# EAGLE design Danyboard_M0 (EAGLE 8.3.1)

## Sheet 1 of 3
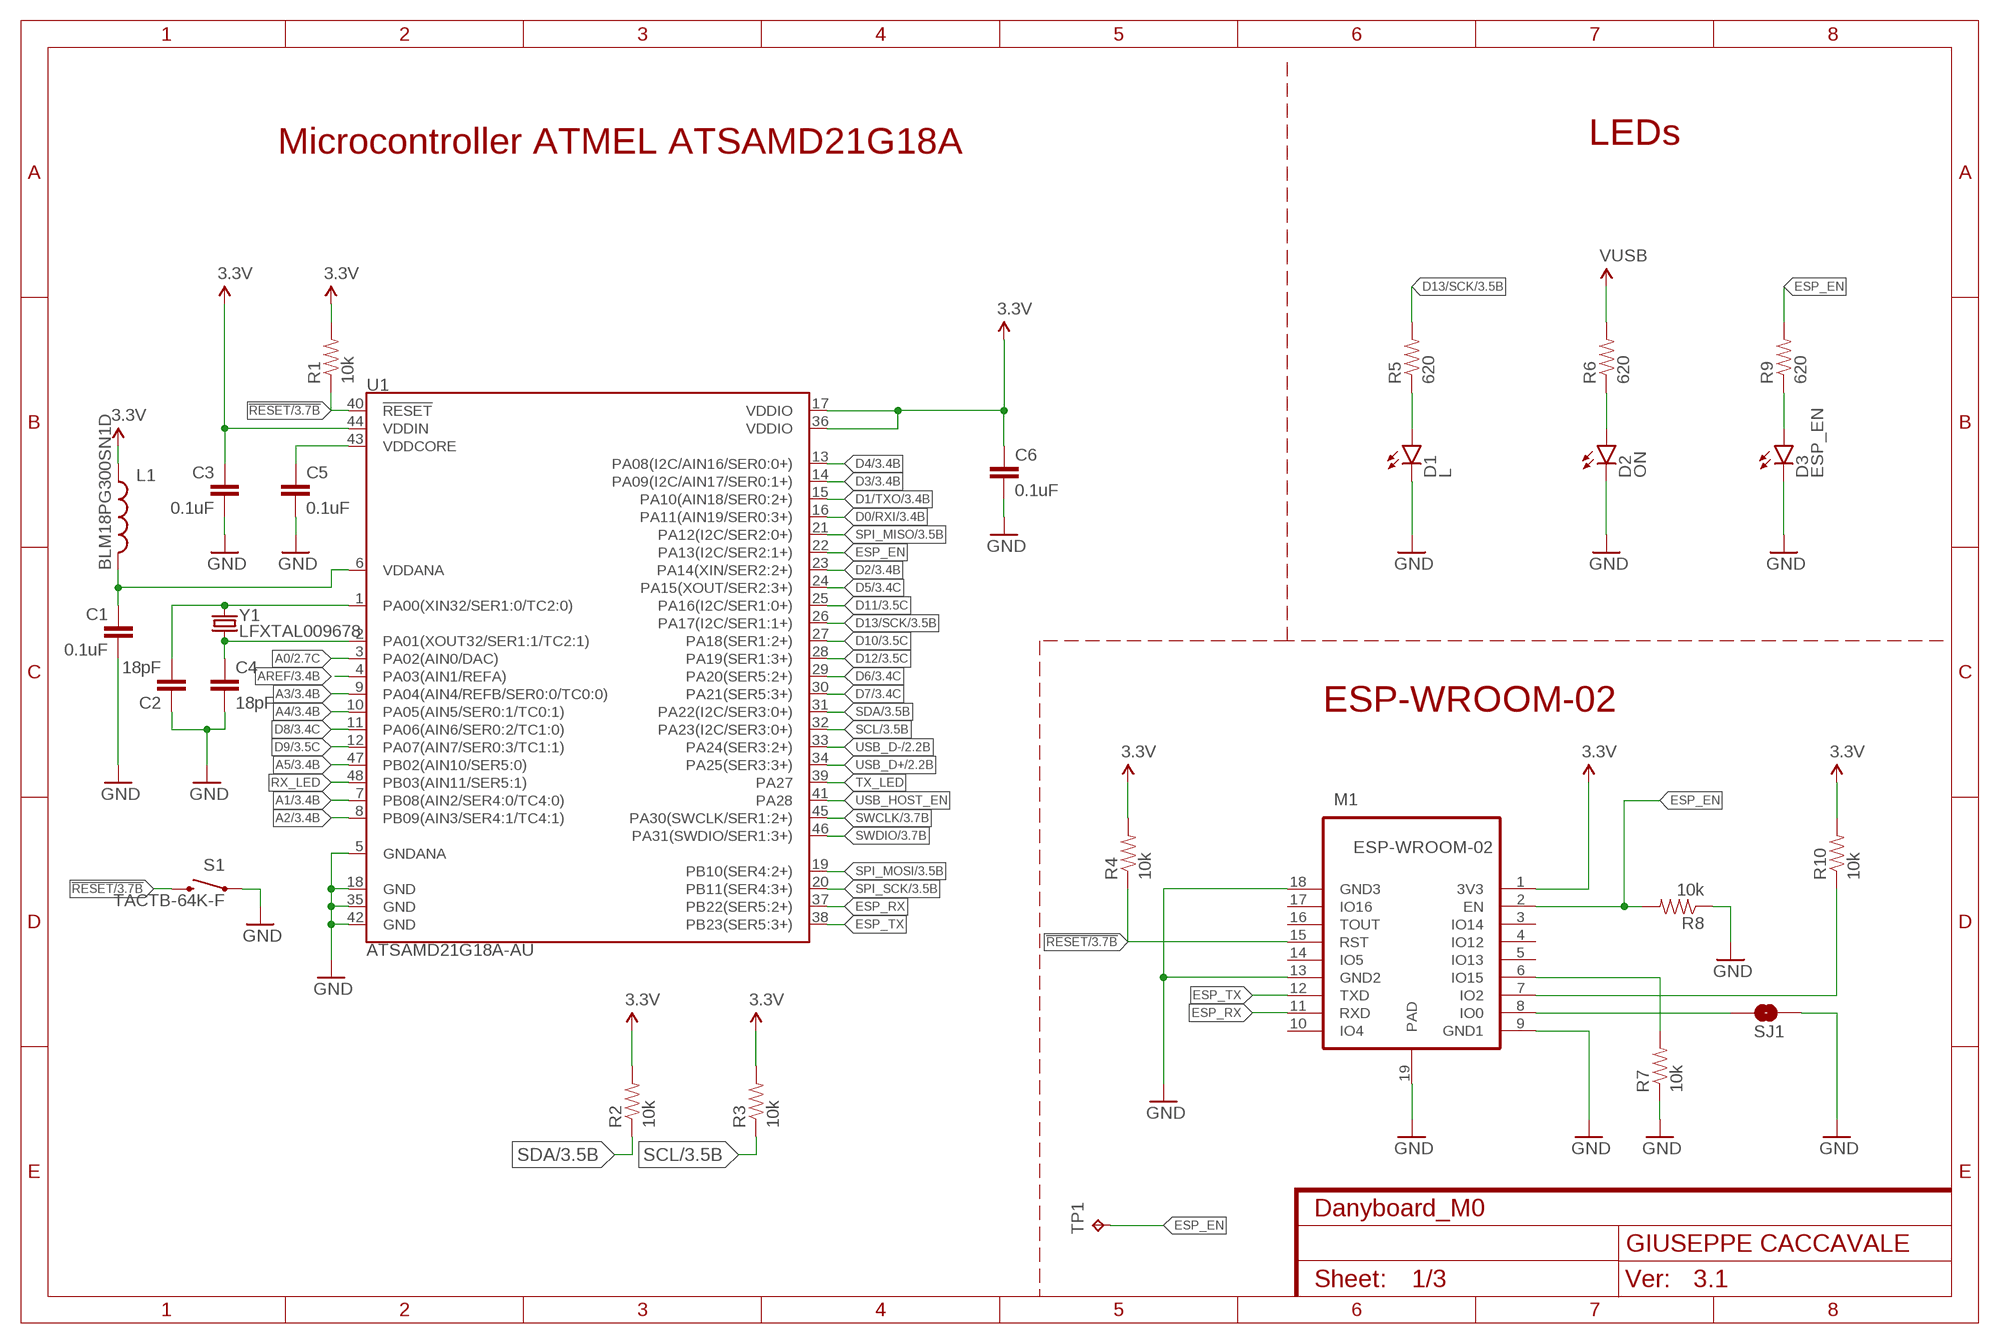
[diagram p0: schematic, sheet 1]

### Parts
C1  0.1uF  CAP0603-CAP_NS  [0603-CAP_NOSILK]
C2  18pF  CAP0603-CAP_NS  [0603-CAP_NOSILK]
C3  0.1uF  CAP0603-CAP_NS  [0603-CAP_NOSILK]
C4  18pF  CAP0603-CAP_NS  [0603-CAP_NOSILK]
C5  0.1uF  CAP0603-CAP_NS  [0603-CAP_NOSILK]
C6  0.1uF  CAP0603-CAP_NS  [0603-CAP_NOSILK]
D1  L  LED-BLUE0603  [LED-0603]
D2  ON  LED-BLUE0603  [LED-0603]
D3  ESP_EN  LED-BLUE0603  [LED-0603]
L1  BLM18PG300SN1D  INDUCTOR0603_NS  [0603_NOSILK]
M1  ESP-WROOM-02  ESP-WROOM-02-NS  [ESP-WROOM-02_NOSILK]
R1  10k  RESISTOR0603-NS  [0603-RES_NOSILK]
R2  10k  RESISTOR0603-NS  [0603-RES_NOSILK]
R3  10k  RESISTOR0603-NS  [0603-RES_NOSILK]
R4  10k  RESISTOR0603-NS  [0603-RES_NOSILK]
R5  620  RESISTOR0603-NS  [0603-RES_NOSILK]
R6  620  RESISTOR0603-NS  [0603-RES_NOSILK]
R7  10k  RESISTOR0603-NS  [0603-RES_NOSILK]
R8  10k  RESISTOR0603-NS  [0603-RES_NOSILK]
R9  620  RESISTOR0603-NS  [0603-RES_NOSILK]
R10  10k  RESISTOR0603-NS  [0603-RES_NOSILK]
S1  TACTB-64K-F  SWITCH-MOMENTARY-2SMD-NS  [TACTILE-SWITCH-SMD_NOSILK]
SJ1  SOLDERJUMPERNO  [SJ_2S-NO]
TP1  ESP8266  TPB1,27  [B1,27]
U1  ATSAMD21G18A-AU  ATSAMD21G-A2  [TQFP-48_NOSILK]
Y1  LFXTAL009678  CRYSTAL3.2X1.5MM_NS  [CRYSTAL-SMD-3.2X1.5MM_NOSILK]

### Nets
3.3V: C3.1 C6.1 L1.1 M1.1(3V3) R1.2 R2.2 R3.2 R4.2 R10.2 U1.17(VDDIO) U1.36(VDDIO) U1.44(VDDIN) ; also sheet 2,3
!RESET: M1.15(RST) R1.1 R4.1 S1.3 U1.40(!RESET!) ; also sheet 3
A0: U1.3(PA02(AIN0/DAC)) ; also sheet 2,3
A1: U1.7(PB08(AIN2/SER4:0/TC4:0)) ; also sheet 3
A2: U1.8(PB09(AIN3/SER4:1/TC4:1)) ; also sheet 3
A3: U1.9(PA04(AIN4/REFB/SER0:0/TC0:0)) ; also sheet 3
A4: U1.10(PA05(AIN5/SER0:1/TC0:1)) ; also sheet 3
A5: U1.47(PB02(AIN10/SER5:0)) ; also sheet 3
AREF: U1.4(PA03(AIN1/REFA)) ; also sheet 3
D0/RXI: U1.16(PA11(AIN19/SER0:3+)) ; also sheet 3
D1/TXO: U1.15(PA10(AIN18/SER0:2+)) ; also sheet 3
D2: U1.23(PA14(XIN/SER2:2+)) ; also sheet 3
D3: U1.14(PA09(I2C/AIN17/SER0:1+)) ; also sheet 3
D4: U1.13(PA08(I2C/AIN16/SER0:0+)) ; also sheet 3
D5: U1.24(PA15(XOUT/SER2:3+)) ; also sheet 3
D6: U1.29(PA20(SER5:2+)) ; also sheet 3
D7: U1.30(PA21(SER5:3+)) ; also sheet 3
D8: U1.11(PA06(AIN6/SER0:2/TC1:0)) ; also sheet 3
D9: U1.12(PA07(AIN7/SER0:3/TC1:1)) ; also sheet 3
D10: U1.27(PA18(SER1:2+)) ; also sheet 3
D11: U1.25(PA16(I2C/SER1:0+)) ; also sheet 3
D12: U1.28(PA19(SER1:3+)) ; also sheet 3
D13/SCK: R5.2 U1.26(PA17(I2C/SER1:1+)) ; also sheet 3
ESP_EN: M1.2(EN) R8.2 R9.2 TP1.TP U1.22(PA13(I2C/SER2:1+))
ESP_RX: M1.11(RXD) U1.37(PB22(SER5:2+))
ESP_TX: M1.12(TXD) U1.38(PB23(SER5:3+))
GND: C1.2 C2.1 C3.2 C4.2 C5.2 C6.2 D1.C D2.C D3.C M1.9(GND1) M1.13(GND2) M1.18(GND3) M1.19(PAD) R7.1 R8.1 S1.1 SJ1.2 U1.5(GNDANA) U1.18(GND) U1.35(GND) U1.42(GND) ; also sheet 2,3
N$2: C2.2 U1.1(PA00(XIN32/SER1:0/TC2:0)) Y1.P$2
N$4: C4.1 U1.2(PA01(XOUT32/SER1:1/TC2:1)) Y1.P$1
N$8: D1.A R5.1
N$11: M1.6(IO15) R7.2
N$12: M1.7(IO2) R10.1
N$13: M1.8(IO0) SJ1.1
N$14: D3.A R9.1
N$15: D2.A R6.1
RX_LED: U1.48(PB03(AIN11/SER5:1))
SCL: R3.1 U1.32(PA23(I2C/SER3:0+)) ; also sheet 3
SDA: R2.1 U1.31(PA22(I2C/SER3:0+)) ; also sheet 3
SPI_MISO: U1.21(PA12(I2C/SER2:0+)) ; also sheet 3
SPI_MOSI: U1.19(PB10(SER4:2+)) ; also sheet 3
SPI_SCK: U1.20(PB11(SER4:3+)) ; also sheet 3
SWCLK: U1.45(PA30(SWCLK/SER1:2+)) ; also sheet 3
SWDIO: U1.46(PA31(SWDIO/SER1:3+)) ; also sheet 3
TX_LED: U1.39(PA27)
USB_D+: U1.34(PA25(SER3:3+)) ; also sheet 2
USB_D-: U1.33(PA24(SER3:2+)) ; also sheet 2
USB_HOST_EN: U1.41(PA28)
VDDANA: C1.1 L1.2 U1.6(VDDANA)
VDDCORE: C5.1 U1.43(VDDCORE)
VUSB: R6.2 ; also sheet 2,3
Unconnected: M1.3(IO14) M1.4(IO12) M1.5(IO13) M1.10(IO4) M1.14(IO5) M1.16(TOUT) M1.17(IO16)

### Notes on the sheet
- Microcontroller ATMEL ATSAMD21G18A
- LEDs
- ESP-WROOM-02
- 3.1

## Sheet 2 of 3
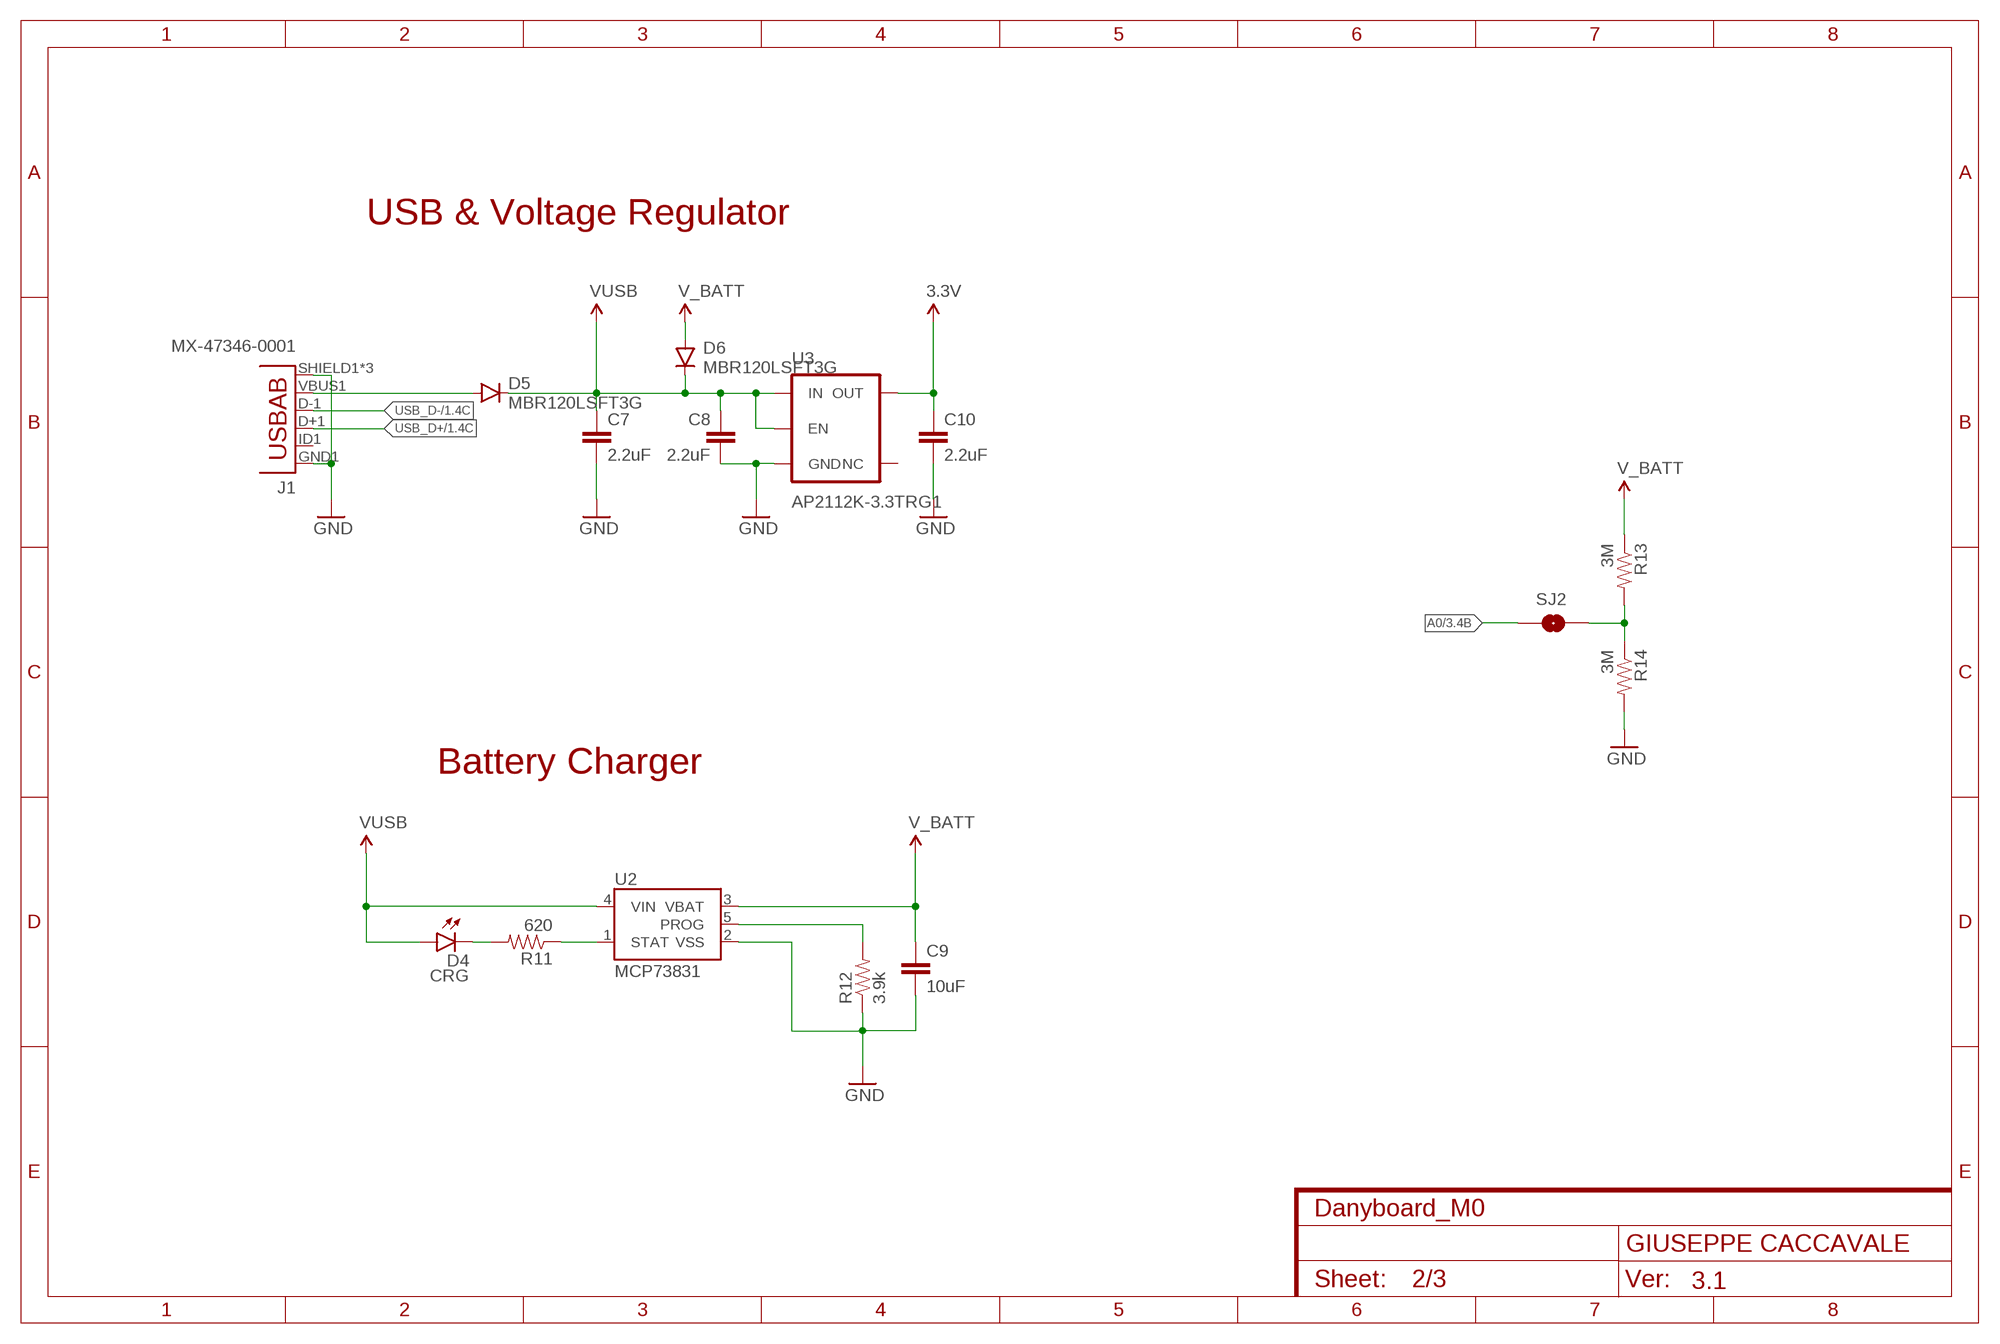
[diagram p1: schematic, sheet 2]

### Parts
C7  2.2uF  CAP0603-CAP_NS  [0603-CAP_NOSILK]
C8  2.2uF  CAP0603-CAP_NS  [0603-CAP_NOSILK]
C9  10uF  CAP0603-CAP_NS  [0603-CAP_NOSILK]
C10  2.2uF  CAP0603-CAP_NS  [0603-CAP_NOSILK]
D4  CRG  LED0603  [LED-0603]
D5  MBR120LSFT3G  DIODESOD123_NS  [SOD-123_NOSILK]
D6  MBR120LSFT3G  DIODESOD123_NS  [SOD-123_NOSILK]
J1  MX-47346-0001  USB-ABCONN-11794  [USB-AB-MICRO-SMD_V03]
R11  620  RESISTOR0603-NS  [0603-RES_NOSILK]
R12  3.9k  RESISTOR0603-NS  [0603-RES_NOSILK]
R13  3M  RESISTOR0603-NS  [0603-RES_NOSILK]
R14  3M  RESISTOR0603-NS  [0603-RES_NOSILK]
SJ2  SOLDERJUMPERNO  [SJ_2S-NO]
U2  MCP73831  [SOT23-5]
U3  AP2112K-3.3TRG1  V_REG_AP2112K-3.3V  [SOT23-5]

### Nets
3.3V: C10.1 U3.5(OUT) ; also sheet 1,3
A0: SJ2.1 ; also sheet 1,3
GND: C7.2 C8.2 C9.2 C10.2 J1.GND1(GND) J1.SHIELD1(SHIELD) J1.SHIELD2(SHIELD) J1.SHIELD3(SHIELD) R12.1 R14.2 U2.2(VSS) U3.2(GND) ; also sheet 1,3
N$3: D4.C R11.2
N$5: R11.1 U2.1(STAT)
N$6: R12.2 U2.5(PROG)
N$10: R13.2 R14.1 SJ2.2
N$18: D5.A J1.VBUS1(VBUS)
USB_D+: J1.D+1(D+) ; also sheet 1
USB_D-: J1.D-1(D-) ; also sheet 1
V_BATT: C9.1 D6.A R13.1 U2.3(VBAT) ; also sheet 3
VUSB: C7.1 C8.1 D4.A D5.C D6.C U2.4(VIN) U3.1(IN) U3.3(EN) ; also sheet 1,3
Unconnected: J1.ID1(USBID) U3.4(NC)

### Notes on the sheet
- USB & Voltage Regulator
- Battery Charger
- 3.1

## Sheet 3 of 3
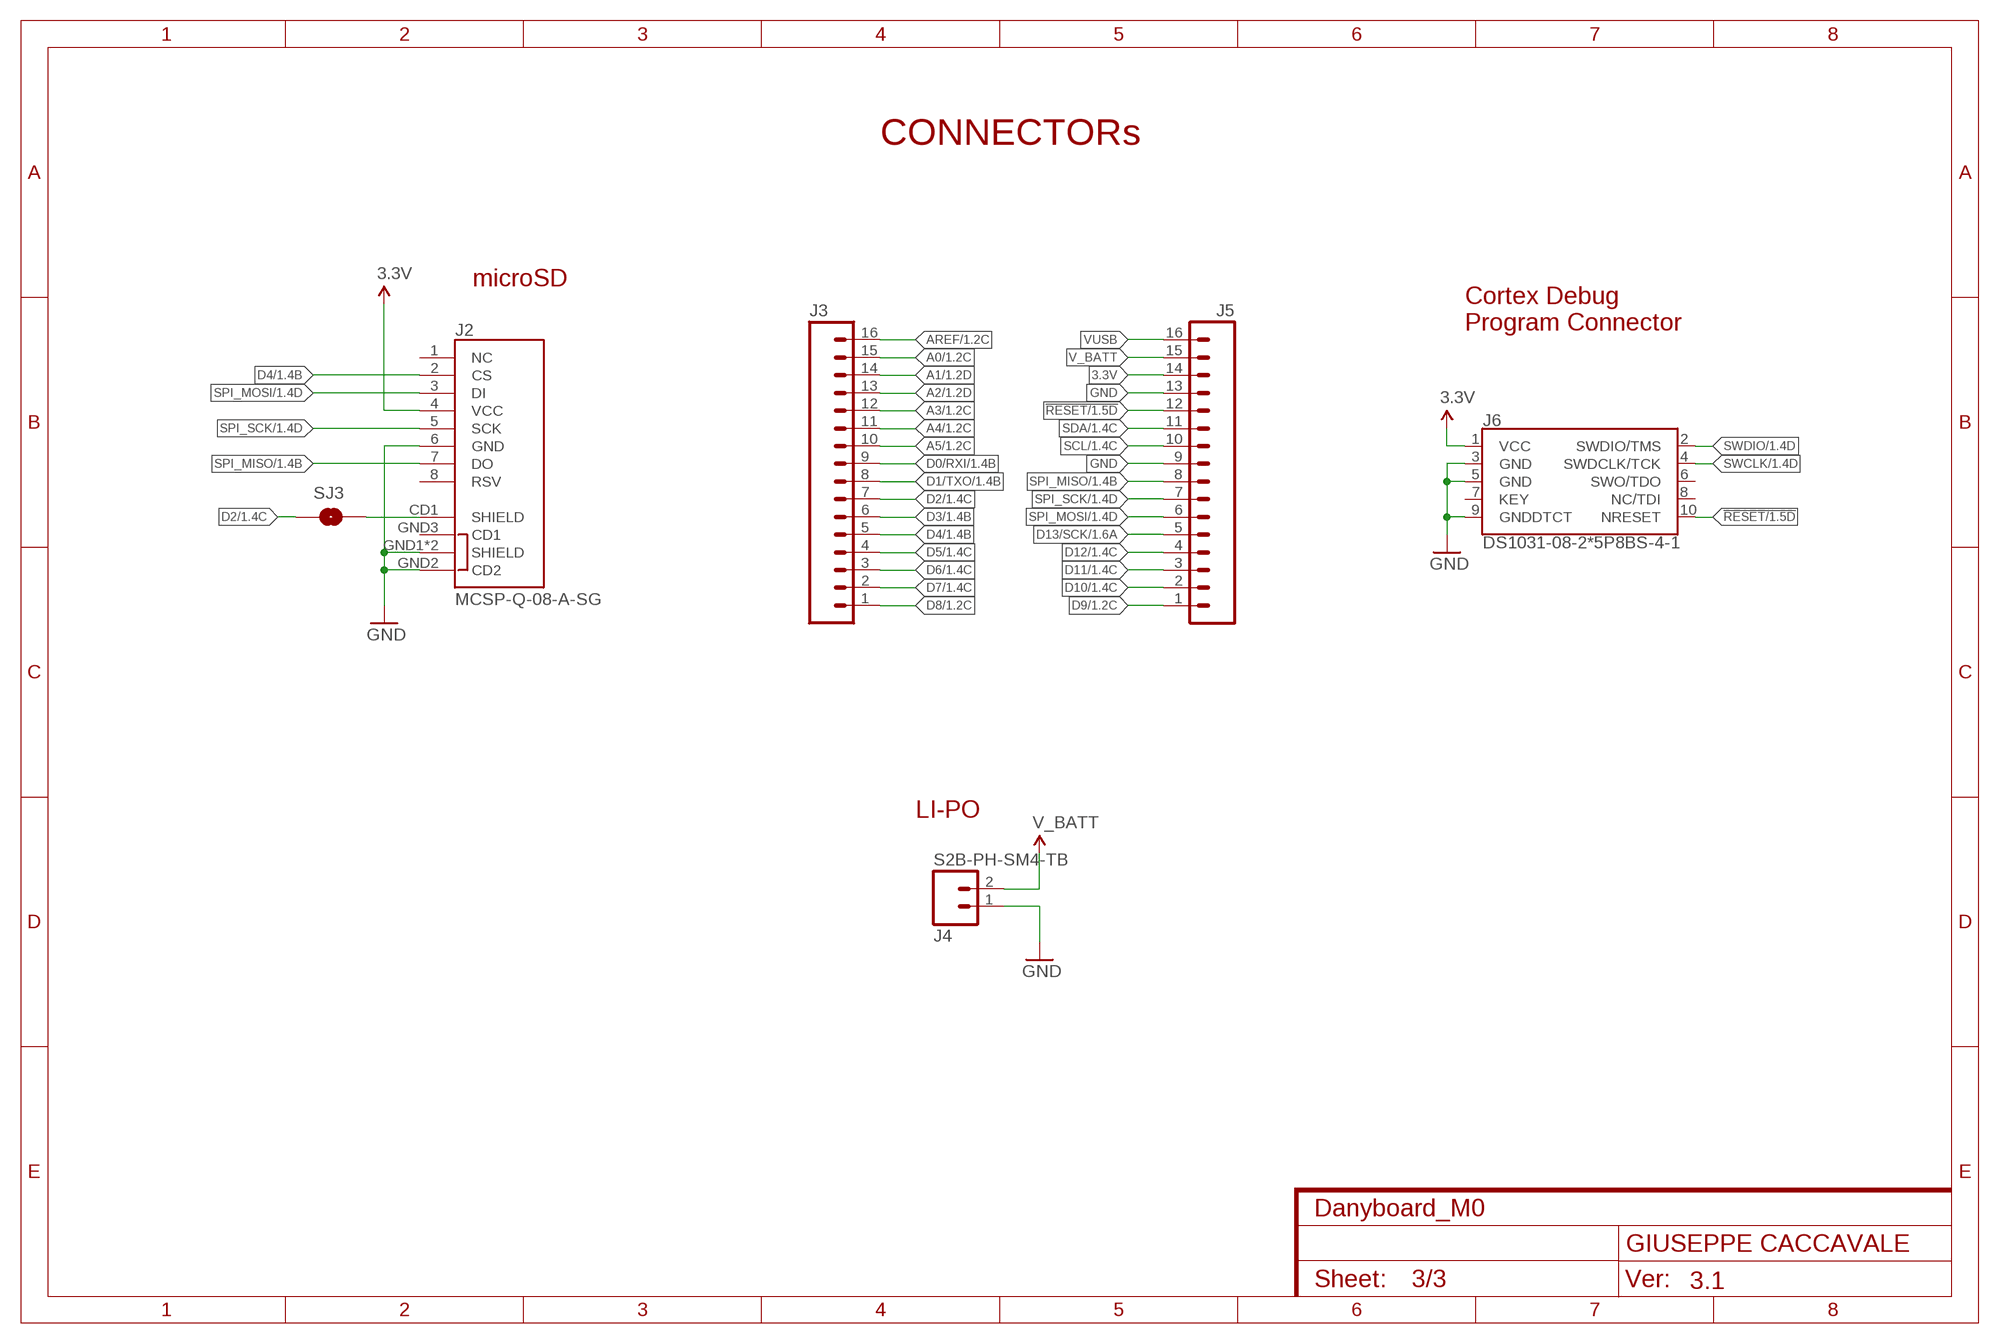
[diagram p2: schematic, sheet 3]

### Parts
J2  MCSP-Q-08-A-SG  USD-SOCKET-NS  [MCSP-Q-08-A-SG-T_NOSILK]
J3  M161X16_NO_SILK  [1X16_NO_SILK]
J4  S2B-PH-SM4-TB  M02-JST-2MM-SMT_NS  [JST-2-SMD_NOSILK]
J5  M161X16_NO_SILK  [1X16_NO_SILK]
J6  DS1031-08-2*5P8BS-4-1  CORTEX_DEBUGSMD2  [SAMTECH_FTSH-105-01_NOSILK]
SJ3  SOLDERJUMPERNO  [SJ_2S-NO]

### Nets
3.3V: J2.4(VCC) J5.14 J6.1(VCC) ; also sheet 1,2
!RESET: J5.12 J6.10(NRESET) ; also sheet 1
A0: J3.15 ; also sheet 1,2
A1: J3.14 ; also sheet 1
A2: J3.13 ; also sheet 1
A3: J3.12 ; also sheet 1
A4: J3.11 ; also sheet 1
A5: J3.10 ; also sheet 1
AREF: J3.16 ; also sheet 1
D0/RXI: J3.9 ; also sheet 1
D1/TXO: J3.8 ; also sheet 1
D2: J3.7 SJ3.1 ; also sheet 1
D3: J3.6 ; also sheet 1
D4: J2.2(CS) J3.5 ; also sheet 1
D5: J3.4 ; also sheet 1
D6: J3.3 ; also sheet 1
D7: J3.2 ; also sheet 1
D8: J3.1 ; also sheet 1
D9: J5.1 ; also sheet 1
D10: J5.2 ; also sheet 1
D11: J5.3 ; also sheet 1
D12: J5.4 ; also sheet 1
D13/SCK: J5.5 ; also sheet 1
GND: J2.6(GND) J2.GND1(SHIELD) J2.GND2(CD2) J2.GND4(SHIELD) J4.1 J5.9 J5.13 J6.3(GND) J6.5(GND) J6.9(GNDDTCT) ; also sheet 1,2
N$16: J2.CD1(SHIELD) SJ3.2
SCL: J5.10 ; also sheet 1
SDA: J5.11 ; also sheet 1
SPI_MISO: J2.7(DO) J5.8 ; also sheet 1
SPI_MOSI: J2.3(DI) J5.6 ; also sheet 1
SPI_SCK: J2.5(SCK) J5.7 ; also sheet 1
SWCLK: J6.4(SWDCLK/TCK) ; also sheet 1
SWDIO: J6.2(SWDIO/TMS) ; also sheet 1
V_BATT: J4.2 J5.15 ; also sheet 2
VUSB: J5.16 ; also sheet 1,2
Unconnected: J2.1(NC) J2.8(RSV) J2.GND3(CD1) J6.6(SWO/TDO) J6.7(KEY) J6.8(NC/TDI)

### Notes on the sheet
- CONNECTORs
- microSD
- Cortex Debug
  Program Connector
- LI-PO
- 3.1

## Library data of the parts
C1-C10 = Danyboard:CAP: Capacitor Standard 0603 ceramic capacitor, and 0.1" leaded capacitor.
D1-D3 = SparkFun-LED:LED-BLUE: Blue LEDs for production use Various blue LEDs stocked by SparkFun production 0603 - DIO-08575 Rebel - DIO-09553 1206 - DIO-09911; PROD_ID: DIO-08575; VALUE: BLUE
D4 = SparkFun-LED:LED: LEDs Standard schematic elements and footprints for 5mm, 3mm, 1206, and 0603 sized LEDs. 5mm - Spark Fun Electronics SKU : COM-00529 (and others)
D5 D6 = Danyboard:DIODE: Diode These are standard reverse protection diodes and small signal diodes. SMA package can handle up to about 1A. SOD-323 can handle about 200mA. What the SOD-323 package when ordering, there are some mfgs out there that are 5-pin packages.
J1 = Danyboard:USB-AB: This is a USB AB connector that is compatible with USB OTG. i.e. this connector can serve as a host or device; PROD_ID: CONN-11794
J2 = Danyboard:USD-SOCKET: microSD Socket Push-push type uSD socket. Schematic element and footprint production proven. Spark Fun Electronics SKU : PRT-00127. tDoc lines correctly indicate media card edge positions when inserting (unlocked, locked, depressed). NOTE: CD1 and CD2 are connected internally
J3 J5 = SparkFun-Connectors:M16: 1x16 .1" header
J4 = Danyboard:M02: Standard 2-pin 0.1" header. Use with - straight break away headers ( PRT-00116) - right angle break away headers (PRT-00553) - swiss pins (PRT-00743) - machine pins (PRT-00117) - female headers (PRT-00115) Molex polarized connector foot print use with: PRT-08233 with associated crimp pins and housings. 2.54_SCREWTERM for use with PRT-10571. 3.5mm Screw Terminal footprints for PRT-08084 5mm Screw Terminal footprints for use with PRT-08432
J6 = Danyboard:CORTEX_DEBUG: Cortex Debug Connector Datasheet <http://infocenter.arm.com/help/topic/com.arm.doc.faqs/attached/13634/cortex_debug_connectors.pdf>
L1 = Danyboard:INDUCTOR: Inductors Basic Inductor/Choke - 0603 and 1206. Footprints are not proven and vary greatly between part numbers. INDUCTOR POWER 3.3UH 4.0A SMD 0.197" L x 0.197" W x 0.177" H (5.00mm x 5.00mm x 4.50mm); PROD_ID: RES-07859
M1 = Danyboard:ESP-WROOM-02: WiFi module - ESP-WROOM-02
R1-R14 = Danyboard:RESISTOR: Resistor Basic schematic elements and footprints for 0603, 1206, and PTH resistors.
S1 = Danyboard:SWITCH-MOMENTARY-2: Various NO switches- pushbuttons, reed, etc
SJ1-SJ3 = SparkFun-Retired:SOLDERJUMPER: Solder Jumper Standard SMD solder jumper. Used to automate production. Two varients : Normally Open and Normally Closed are the same, but have different paste layers. NC will have a large amount of paste and should jumper during reflow.
TP1 = testpad:TP: Test pad
U1 = Danyboard:ATSAMD21G: Atmel SAMD21G SMART ARM-Based Microcontroller The Atmel ® | SMART  SAM D21 is a series of low-power microcontrollers using the 32-bit ARM ® Cortex ® -M0+ processor, and ranging from 32- to 64-pins with up to 256KB Flash and 32KB of SRAM. The SAM D21 devices operate at a maximum frequency of 48MHz and reach 2.46 CoreMark/MHz. They are designed for simple and intuitive migration with identical peripheral modules, hex compatible code, identical linear address map and pin compatible migration paths between all devices in the product series. All devices include intelligent and flexible peripherals, Atmel Event System for inter-peripheral signaling, and support for capacitive touch button, slider and wheel user interfaces.
U2 = SparkFun-PowerIC:MCP73831: Miniature single cell, fully integrated Li-Ion, Li-polymer charge management controller http://ww1.microchip.com/downloads/en/DeviceDoc/20001984g.pdf IC-09995; PROD_ID: IC-09995
U3 = SparkFun-PowerIC:V_REG_AP2112: AP2112 - 600mA CMOS LDO Regulator w/ Enable The AP2112 is CMOS process low dropout linear regulator with enable function, the regulator delivers a guaranteed 600mA (min.) continuous load current. Features Output Voltage Accuracy: ±1.5% Output Current: 600mA (Min.) Foldback Short Current Protection: 50mA Enable Function to Turn ON/OFF VOUT Low Dropout Voltage (3.3V): 250mV (Typ.) @IOUT=600mA Excellent Load Regulation: 0.2%/A (Typ.) Excellent Line Regulation: 0.02%/V (Typ.) Low Quiescent Current: 55μA (Typ.) Low Standby Current: 0.01μA (Typ.) Low Output Noise: 50μVRMS PSRR: 100Hz -65dB, 1kHz -65dB OTSD Protection Stable with 1.0μF Flexible Cap: Ceramic, Tantalum and Aluminum Electrolytic Operation Temperature Range: -40°C to 85°C ESD: MM 400V, HBM 4000V; PROD_ID: VREG-12457; VALUE: 3.3V
Y1 = Danyboard:CRYSTAL: Various standard crystals. Proven footprints.

## Board
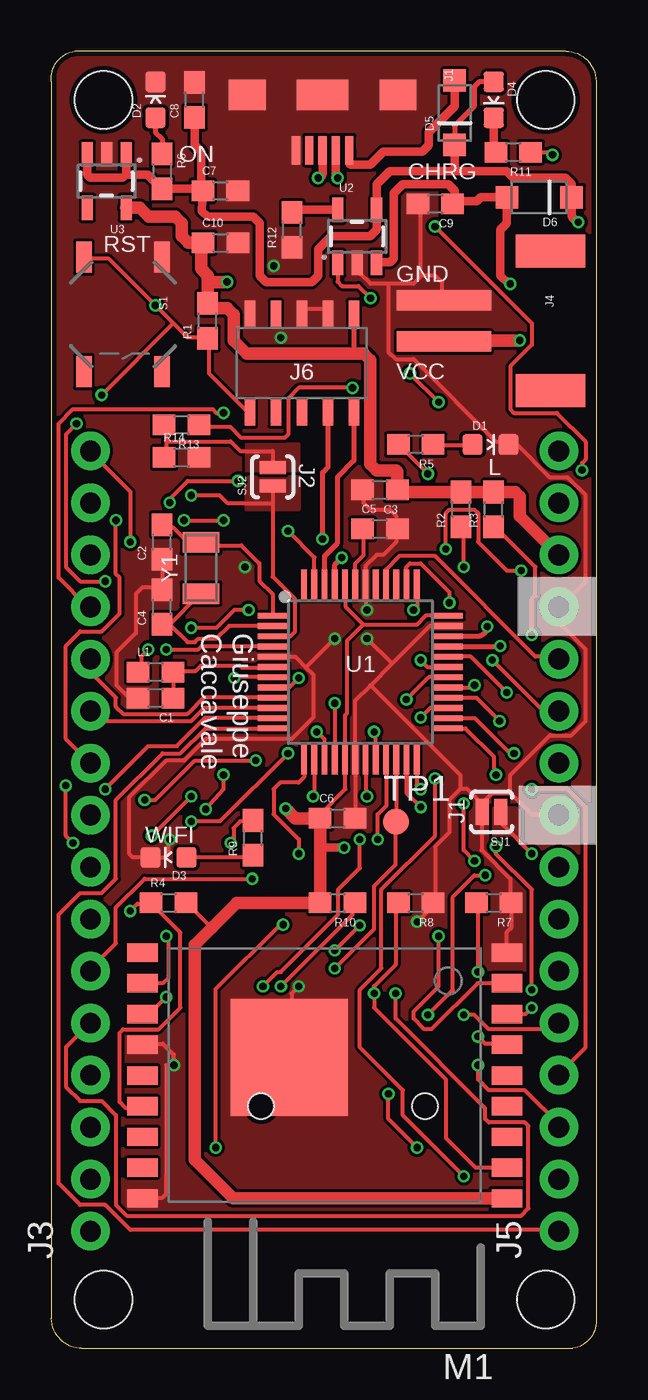
[diagram p3: board, top side]
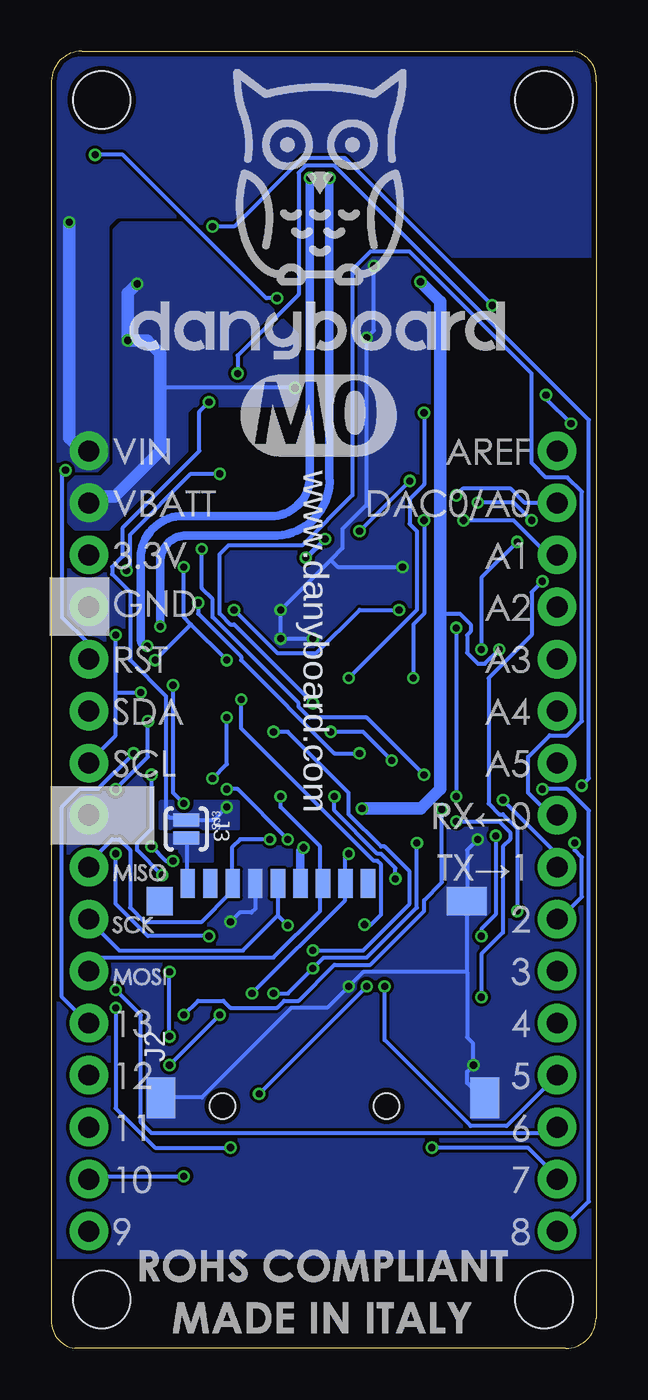
[diagram p4: board, bottom side, seen from below]

Size 26.61 x 63.34 mm. Coordinates in mm from the lower left corner, seen from the top.
Outline: 1.5,0 25.45,0 arc89 26.6,1.49 26.6,61.87 arc89 25.12,63.34 1.15,63.34 arc89 0.01,61.85 0.01,1.46 arc89 1.5,0
Copper layers (1*16): Top 0.018mm / dielectric 1.55mm / Bottom 0.018mm
Design rules "eC_2Layer_PClass6_BaseCopperO18_eCDefault": minimum track width 0.15mm, minimum drill 0.35mm, track to track 0.15mm, track to pad 0.15mm, pad to pad 0.15mm, via to via 0.15mm, smd to smd 0mil, copper to edge 0.25mm, drill to drill 0.35mm, minimum pad ring 0.175mm, minimum via ring 0.125mm, stop-mask expansion 0mil, vias tented up to drill 0.45mm, thermal gap 0.2mm
Holes 2.8 mm at 24.14,60.96 2.55,60.96 2.55,2.38 24.14,2.38

### Footprints (pad centres in the part's own frame; a part is rotated, then mirrored left to right if it is on the bottom)
0603-CAP_NOSILK = smd 1.1 x 1: 1 -0.85,0; 2 0.85,0
LED-0603 = smd 1 x 1: A 0,-0.877; C 0,0.877
SOD-123_NOSILK = smd 1.1 x 1.1: A 1.575,0; C -1.575,0
USB-AB-MICRO-SMD_V03 = smd 1.4 x 0.4: D+1 2.7,0; D-1 2.7,0.65; GND1 2.7,-1.3; ID1 2.7,-0.65; VBUS1 2.7,1.3 | smd 1.5 x 1.8: SHIELD1 0,3.68; SHIELD3 0,-3.68 | smd 1.5 x 2.5: SHIELD2 0,0
MCSP-Q-08-A-SG-T_NOSILK = smd 0.7 x 1.4: 1 2.2,6.35; 2 1.1,6.35; 3 0,6.35; 4 -1.1,6.35; 5 -2.2,6.35; 6 -3.3,6.35; 7 -4.4,6.35; 8 -5.5,6.35; CD1 -6.6,6.35 | smd 1.4 x 2: GND1 -7.9,-4.12; GND2 7.9,-4.12 | smd 1.28 x 1.4: GND3 -7.96,5.48 | smd 1.95 x 1.4: GND4 7.025,5.48 | hole 1.25: 3.1,-4.52; -4.9,-4.52
1X16_NO_SILK = drill 1.016 pad 1.88: 1 0,0; 2 2.54,0; 3 5.08,0; 4 7.62,0; 5 10.16,0; 6 12.7,0; 7 15.24,0; 8 17.78,0; 9 20.32,0; 10 22.86,0; 11 25.4,0; 12 27.94,0; 13 30.48,0; 14 33.02,0; 15 35.56,0; 16 38.1,0
JST-2-SMD_NOSILK = smd 1 x 4.6: 1 -1,-3.7; 2 1,-3.7 | smd 1.6 x 3.4: NC1 -3.4,1.5; NC2 3.4,1.5
SAMTECH_FTSH-105-01_NOSILK = smd 0.508 x 1.27: 1 -2.54,-2.413; 2 -2.54,2.413; 3 -1.27,-2.413; 4 -1.27,2.413; 5 0,-2.413; 6 0,2.413; 7 1.27,-2.413; 8 1.27,2.413; 9 2.54,-2.413; 10 2.54,2.413
0603_NOSILK = smd 1.1 x 1: 1 -0.85,0; 2 0.85,0
ESP-WROOM-02_NOSILK = smd 1.485 x 0.9: 1 -8.893,4.9; 2 -8.893,3.4; 3 -8.893,1.9; 4 -8.893,0.4; 5 -8.893,-1.1; 6 -8.893,-2.6; 7 -8.893,-4.1; 8 -8.893,-5.6; 9 -8.893,-7.1; 10 8.893,-7.1; 11 8.893,-5.6; 12 8.893,-4.1; 13 8.893,-2.6; 14 8.893,-1.1; 15 8.893,0.4; 16 8.893,1.9; 17 8.893,3.4; 18 8.893,4.9 | smd 5.715 x 5.715: 19 1.72,-1.98
0603-RES_NOSILK = smd 1.1 x 1: 1 -0.85,0; 2 0.85,0
TACTILE-SWITCH-SMD_NOSILK = smd 1.524 x 0.762: 1 -2.794,1.905; 2 2.794,1.905; 3 -2.794,-1.905; 4 2.794,-1.905
SJ_2S-NO = smd 0.635 x 1.27: 1 -0.45,0; 2 0.45,0
B1,27 = smd 1.27 x 1.27: TP 0,0
TQFP-48_NOSILK = smd 1.5 x 0.28: 1 -4.25,2.75; 2 -4.25,2.25; 3 -4.25,1.75; 4 -4.25,1.25; 5 -4.25,0.75; 6 -4.25,0.25; 7 -4.25,-0.25; 8 -4.25,-0.75; 9 -4.25,-1.25; 10 -4.25,-1.75; 11 -4.25,-2.25; 12 -4.25,-2.75; 25 4.25,-2.75; 26 4.25,-2.25; 27 4.25,-1.75; 28 4.25,-1.25; 29 4.25,-0.75; 30 4.25,-0.25; 31 4.25,0.25; 32 4.25,0.75; 33 4.25,1.25; 34 4.25,1.75; 35 4.25,2.25; 36 4.25,2.75 | smd 0.28 x 1.5: 13 -2.75,-4.25; 14 -2.25,-4.25; 15 -1.75,-4.25; 16 -1.25,-4.25; 17 -0.75,-4.25; 18 -0.25,-4.25; 19 0.25,-4.25; 20 0.75,-4.25; 21 1.25,-4.25; 22 1.75,-4.25; 23 2.25,-4.25; 24 2.75,-4.25; 37 2.75,4.25; 38 2.25,4.25; 39 1.75,4.25; 40 1.25,4.25; 41 0.75,4.25; 42 0.25,4.25; 43 -0.25,4.25; 44 -0.75,4.25; 45 -1.25,4.25; 46 -1.75,4.25; 47 -2.25,4.25; 48 -2.75,4.25
SOT23-5 = smd 0.55 x 1.2: 1 -0.95,-1.3; 2 0,-1.3; 3 0.95,-1.3; 4 0.95,1.3; 5 -0.95,1.3
CRYSTAL-SMD-3.2X1.5MM_NOSILK = smd 1 x 1.8: P$1 -1.25,0; P$2 1.25,0

### Placement (x,y rotation side)
C1  5.09,31.75 180 top
C2  5.41,39.37 90 top
C3  16.04,41.91 180 top
C4  5.41,36.2 90 top
C5  16.04,40.01 0 top
C6  13.98,25.88 0 top
C7  8.26,56.52 0 top
C8  6.99,60.96 90 top
C9  18.74,55.88 180 top
C10  8.26,53.98 0 top
D1  21.44,44.13 270 top
D2  5.09,60.96 0 top
D3  5.72,23.97 90 top
D4  21.6,60.96 180 top
D5  19.69,60.33 90 top
D6  23.82,56.2 180 top
J1  13.24,61.2 270 top
J2  13.34,16.35 0 bottom
J3  1.91,5.71 90 top
J4  22.87,50.16 270 top
J5  24.77,5.71 90 top
J6  12.23,48.1 180 top
L1  5.09,33.02 0 top
M1  13.34,12.22 180 top
R1  7.63,50.16 90 top
R2  20.01,40.96 90 top
R3  21.6,40.96 90 top
R4  5.72,21.75 0 top
R5  17.79,44.13 180 top
R6  5.41,57.47 270 top
R7  21.6,21.75 180 top
R8  17.79,21.75 180 top
R9  9.85,24.92 90 top
R10  13.98,21.75 180 top
R11  22.55,58.4 180 top
R12  11.76,54.61 90 top
R13  6.36,45.09 180 top
R14  6.36,43.5 0 top
S1  3.5,50.48 270 top
SJ1  21.5,26.19 180 top
SJ2  10.8,42.55 90 top
SJ3  20.01,25.36 270 bottom
TP1  16.84,25.72 0 top
U1  15.09,33.02 0 top
U2  14.93,54.29 0 top
U3  2.71,56.99 180 top
U$2  [DANYBOARD_M0_FONTPRINT_BOTTOM_NEW]  26.68,0 0 bottom
Y1  7.31,38.1 90 top

### Tracks (layer width: path | path; a pad name or v marks a point on that pad's centre or on a via)
3.3V  (via drill 0.35)
  Top 0.2: 15.23,35.35 17.86,35.35 18.28,35.77 U1.36 | 15.23,35.35 14.36,36.23 14.36,37.1 U1.44 | v4.73,34.12 4.38,33.77 4.38,33.08 L1.1 | 7.83,20.52 6.66,21.7 R4.2 | C6.1 13.13,26.07 14.36,27.3 14.36,28.7 U1.17 14.34,30.91 14.44,31.02 14.44,34.56 15.23,35.35
  Top 0.254: J6.1 14.77,48.74 14.93,48.58
  Top 0.406: 7.31,53.92 C10.1 | 13.03,25.77 C6.1 | v14.3,24.45 13.15,24.45 13.15,24.47 | 13.15,24.48 13.15,24.47 | 13.15,24.47 13.13,24.45
  Top 0.61: M1.1 8.88,7.32 6.99,9.21 6.99,19.68 7.83,20.52 9.06,21.75 R10.2 13.13,24.45 C6.1 11.92,25.88 v11.44,26.35 | J5.14 22.87,40.64 22.87,41.59 22.65,41.81 R3.2 R2.2 17,41.81 C3.1 16.89,42.81 16.84,42.86 15.88,42.86 15.57,43.18 15.57,48.26 15.25,48.58 14.93,48.58 9.53,48.58 8.9,49.21 8.9,50.48 8.58,50.8 7.84,50.8 R1.2 7.63,52.07 | 7.63,52.07 7.63,52.39 7.31,52.7 7.31,53.87 C10.1 6.68,53.98 6.36,54.29 6.36,54.93 6.04,55.24 4.77,55.24 4.33,55.69 U3.5 | v8.58,52.07 7.63,52.07
  Bottom 0.2: v4.73,34.12 5.43,33.42 5.78,33.42 6.31,33.95 6.31,34.83 6.13,35 6.13,35.35 6.66,35.88 7.63,35.88
  Bottom 0.406: J2.4 14.44,24.3 v14.3,24.45
  Bottom 0.61: v11.44,26.35 8.58,26.35 7.63,27.3 7.63,35.88 7.63,51.12 v8.58,52.07
!RESET  (via drill 0.35)
  Top 0.2: J5.12 24.68,33.77 23.63,33.77 18.73,38.67 16.98,38.67 16.34,38.03 U1.40 | M1.15 4.38,11.72 3.65,11.72 3.34,12.03 3.34,12.77 3.33,12.78 3.33,15.4 3.51,15.57 5.26,15.57 6.31,16.62 6.31,20.3 4.91,21.7 R4.1 4.73,21.7 4.21,21.7 v3.86,21.35 | J6.10 9.63,45.67 7.71,47.6 7.71,49.17 R1.1 7.53,49.35 6.66,49.35 5.96,50.05 | 5.96,50.05 v5.08,50.92 2.81,53.2 1.76,53.2 S1.3 | v2.63,37.45 1.41,37.45 0.71,38.15 0.71,44.62 v1.23,45.15 | 5.96,50.05 v2.46,46.55 | v25.91,42.88 25.91,43.23 26.08,43.4 26.08,44.27 24.68,45.67 22.58,45.67 22.41,45.85 22.41,47.95 23.46,49 23.46,50.05 v18.73,54.77
  Bottom 0.2: v3.86,21.35 3.86,25.38 4.56,26.07 4.73,26.07 5.26,26.6 5.26,32.73 3.16,34.83 3.16,36.92 v2.63,37.45 | v1.23,45.15 2.46,46.38 v2.46,46.55 | v25.91,42.88 26.08,42.7 26.08,35.7 24.86,34.48 24.86,33.77 J5.12 | v18.73,54.77 17.68,54.77 14.36,58.1 12.26,58.1 v5.08,50.92
A0  (via drill 0.35)
  Top 0.2: U1.3 11.68,34.77 11.91,35 11.91,36.58 10.8,37.68 10.8,41.27 | SJ2.1 10.8,41.27 | v6.83,41.65 8.21,41.65 8.58,41.27 10.8,41.27
  Bottom 0.2: v6.83,41.65 6.48,42 4.21,42 3.51,41.3 1.93,41.3 J3.15
  pour Top (no thermals): 9.85,42.55 12.07,42.55 12.07,40.96 9.53,40.96 9.53,42.55
A1  (via drill 0.35)
  Top 0.2: v6.48,40.42 v8.41,40.42 | U1.7 8.98,32.77 v8.93,32.73
  Bottom 0.2: v8.93,32.73 8.93,35.35 8.41,35.88 v8.41,40.42 | v6.48,40.42 4.03,40.42 2.46,38.85 1.93,38.85 J3.14
A2  (via drill 0.35)
  Top 0.2: v8.41,45.67 8.06,45.67 7.88,45.85 1.06,45.85 0.36,45.15 0.36,37.62 1.76,36.23 J3.13 | U1.8 11.63,32.27 v12.08,32.73
  Bottom 0.2: v12.08,32.73 8.76,36.05 8.76,39.9 9.11,40.25 9.11,41.48 8.41,42.17 v8.41,45.67
A3
  Top 0.2: 1.93,33.25 1.93,33.6 J3.12 1.91,33.02 3.16,31.77 3.16,31.32 3.51,30.98 6.66,30.98 7.45,31.77 U1.9
A4
  Top 0.2: J3.11 1.93,30.98 2.28,30.62 6.83,30.62 7.48,31.27 U1.10
A5  (via drill 0.35)
  Top 0.2: v11.56,39.9 12.84,38.62 U1.47 | v9.11,42.35 6.66,42.35 5.78,41.48 v5.78,41.3 | v3.16,40.42 3.16,37.8 3.33,37.62 3.33,35.88 2.46,35 1.41,35 0.71,34.3 0.71,29.75 1.76,28.7 J3.10
  Bottom 0.2: v9.11,42.35 v11.56,39.9 | v5.78,41.3 4.03,41.3 v3.16,40.42
AREF  (via drill 0.35)
  Top 0.2: v5.61,34.12 7.18,34.12 7.33,34.27 U1.4 | v3.86,39.38 3.86,41.83 1.93,43.75 J3.16
  Bottom 0.2: v5.61,34.12 5.61,37.62 v3.86,39.38
D0/RXI  (via drill 0.35)
  Top 0.2: v13.83,31.5 13.83,28.88 U1.16
  Bottom 0.2: v13.83,31.5 17.68,35.35 17.86,35.35 18.38,35.88 18.38,38.77 17.96,39.2 14.36,39.2 11.91,41.65 11.91,52.67 11.03,53.55 9.11,53.55 3.16,47.6 3.16,43.23 2.46,42.52 1.41,42.52 0.71,41.83 0.71,30.62 1.41,29.93 2.28,29.93 3.33,28.88 3.33,27.12 2.28,26.07 1.93,26.07 J3.9
D1/TXO  (via drill 0.35)
  Top 0.2: v12.96,30.1 13.34,29.72 U1.15 | v9.98,28.7 7.01,28.7 5.08,26.77 v4.56,26.77
  Bottom 0.2: v12.96,30.1 11.38,30.1 v9.98,28.7 | v4.56,26.77 1.93,24.15 1.93,23.62 J3.8
D2  (via drill 0.35)
  Top 0.2: v18.03,26.43 17.33,27.12 17.33,28.7 U1.23 | v17.51,47.6 v18.91,46.2 | v0.71,27.48 0.71,25.02 v1.06,24.68
  Bottom 0.2: v18.03,26.43 18.65,25.81 SJ3.1 | 19.96,25.9 SJ3.1 | v17.51,47.6 17.51,48.48 14.53,51.45 14.53,57.4 14.18,57.75 12.78,57.75 0.36,45.33 0.36,27.82 v0.71,27.48 | v1.06,24.68 1.06,24.32 0.71,23.98 0.71,22.05 1.76,21 J3.7 | SJ3.1 20.04,25.81 20.13,25.9 20.83,25.9 21.01,26.08 21.01,31.85 22.76,33.6 22.76,36.92 23.63,37.8 23.63,38.15 23.11,38.67 23.11,40.08 19.38,43.81 19.38,45.73 v18.91,46.2
  pour Bottom (no thermals): 18.74,25.4 17.47,25.4 17.47,26.67 21.28,26.67 21.28,25.4 19.06,25.4
D3  (via drill 0.35)
  Top 0.2: v9.81,22.93 4.56,22.93 3.16,21.52 3.16,19.77 1.93,18.55 J3.6 | U1.14 12.84,27.01 v12.78,26.95
  Bottom 0.2: v12.78,26.95 12.78,26.25 10.68,24.15 10.51,24.15 9.81,23.45 v9.81,22.93
D4  (via drill 0.35)
  Top 0.2: v12.08,24.15 12.08,24.85 10.86,26.07 10.86,27.3 11.18,27.62 12.07,27.62 12.34,27.89 U1.13 | v16.81,17.32 16.81,16.1 21.18,11.72 21.18,11.2 21.36,11.03 23.11,11.03 23.28,10.85 23.28,6.83 22.93,6.47 3.68,6.47 3.16,7 3.16,11.38 2.46,12.07 1.41,12.07 0.71,12.78 0.71,14.7 1.76,15.75 J3.5
  Bottom 0.2: v16.81,17.32 12.26,21.88 12.26,22.69 J2.2 12.24,23.99 v12.08,24.15
D5  (via drill 0.35)
  Top 0.2: v15.06,24.85 15.06,23.45 14.01,22.4 14.01,21.18 11.21,18.38 11.03,18.38 v10.33,17.68 | U1.24 17.84,27.49 v18.03,27.3
  Bottom 0.2: v18.03,27.3 17.51,27.3 v15.06,24.85 | v10.33,17.68 10.33,15.05 6.13,10.85 4.38,10.85 1.93,13.3 J3.4
D6  (via drill 0.35)
  Top 0.2: v20.13,26.6 20.13,24.32 v20.66,23.8 | v21.71,24.5 21.71,24.15 23.46,22.4 v23.46,17.5 | U1.29 20.55,32.27 v20.66,32.38
  Bottom 0.2: v20.66,32.38 20.66,27.12 v20.13,26.6 | v20.66,23.8 21.01,23.8 v21.71,24.5 | v23.46,17.5 22.23,16.27 22.23,11.03 21.71,10.5 2.11,10.5 1.93,10.68 J3.3
D7  (via drill 0.35)
  Top 0.2: v17.33,31.68 18.43,32.77 U1.30 | v8.03,9.8 8.03,17.54 11.17,20.68 v11.32,20.68
  Bottom 0.2: v17.33,31.68 17.33,30.27 10.86,23.8 10.68,23.8 10.51,23.62 10.51,21.18 11,20.68 v11.32,20.68 | v8.03,9.8 3.33,9.8 1.93,8.4 J3.2
D8  (via drill 0.35)
  Top 0.2: v2.63,27.3 4.73,29.4 6.13,29.4 7.5,30.77 U1.11
  Bottom 0.2: v2.63,27.3 1.41,27.3 0.36,26.25 0.36,7.17 1.76,5.78 J3.1
D9
  Top 0.2: U1.12 10.68,30.27 7.53,30.27 6.31,29.05 5.43,29.05 3.16,26.77 3.16,22.93 2.46,22.23 1.41,22.23 0.36,21.18 0.36,8.05 1.41,7 2.63,7 3.86,5.78 24.68,5.78 J5.1
D10  (via drill 0.35)
  Top 0.2: v18.73,27.82 18.73,25.02 16.11,22.4 16.11,18.55 15.06,17.5 15.06,14.7 17.16,12.6 17.16,11.38 v20.13,8.4 | U1.27 18.5,31.27 v18.03,30.8
  Bottom 0.2: v18.03,30.8 18.03,28.52 v18.73,27.82 | v20.13,8.4 24.68,8.4 J5.2
D11  (via drill 0.35)
  Top 0.2: v21.18,23.1 20.66,23.1 19.61,22.05 19.61,17.5 v18.38,16.27 | v20.83,13.82 20.83,13.12 21.36,12.6 23.11,12.6 24.86,10.85 J5.3 | U1.25 19.43,30.27 20.22,30.27 21.6,28.89 21.6,28.11 v21.71,28
  Bottom 0.2: v21.71,28 21.71,25.38 22.41,24.68 22.41,24.32 v21.18,23.1 | v20.83,13.82 v18.38,16.27
D12  (via drill 0.35)
  Top 0.2: v21.88,30.62 20.74,31.77 U1.28 | v23.46,27.3 25.21,27.3 26.08,26.43 26.08,14.7 24.86,13.47 J5.4
  Bottom 0.2: v21.88,30.62 21.88,28.88 v23.46,27.3
D13/SCK  (via drill 0.35)
  Top 0.2: v18.38,42.7 16.98,44.1 R5.2 | v22.93,37.98 22.23,37.98 20.83,39.38 20.83,40.77 20.66,40.95 19.43,40.95 19.26,40.77 v19.26,39.02 | v8.41,28 8.41,27.3 v7.54,26.33 | v20.13,16.27 20.66,16.27 21.36,15.57 24.51,15.57 24.68,15.75 J5.5 | U1.26 20.67,30.77 22.39,29.05 v22.58,29.05
  Bottom 0.2: v18.38,42.7 19.78,42.7 22.76,39.73 22.76,38.15 v22.93,37.98 | v19.26,39.02 19.26,37.1 18.73,36.58 18.73,35.7 14.53,31.5 14.53,31.32 14.01,30.8 11.21,30.8 v8.41,28 | v7.54,26.33 7.53,22.75 8.41,21.88 8.41,21.35 11.03,18.73 12.78,18.73 14.53,16.98 15.23,16.98 15.58,16.62 17.86,16.62 18.21,16.98 19.43,16.98 v20.13,16.27 | v22.58,29.05 24.33,27.3 25.21,27.3 26.08,26.43 26.08,17.15 24.86,15.93 J5.5
ESP_EN  (via drill 0.35)
  Top 0.2: 16.81,25.73 TP1.TP | R9.2 9.81,25.73 9.22,25.73 8.9,25.4 8.9,24.82 v8.76,24.68 | R8.2 16.81,21.7 16.81,18.73 15.76,17.68 v15.76,17.32 15.76,16.62 19.26,13.12 19.26,10.28 20.71,8.82 M1.2 | v13.83,18.55 15.76,20.48 15.76,22.57 16.81,23.62 16.81,25.55 TP1.TP | U1.22 TP1.TP
  Bottom 0.2: v8.76,24.68 8.76,21.52 11.21,19.07 13.31,19.07 v13.83,18.55 15.06,17.32 v15.76,17.32
ESP_RX  (via drill 0.35)
  Top 0.2: v6.83,26.95 v4.91,25.02 | v6.83,35.17 8.06,35.17 8.93,36.05 v9.63,36.05 | M1.11 4.56,17.85 5.48,17.85 5.72,18.1 5.72,20.01 v5.61,20.12 | U1.37 17.86,37.1 17.86,36.23 v17.68,36.05
  Bottom 0.2: v5.61,20.12 5.61,20.48 4.91,21.18 v4.91,25.02 | v6.83,35.17 v6.83,26.95 | v9.63,36.05 11.56,36.05 13.66,33.95 15.58,33.95 v17.68,36.05
ESP_TX  (via drill 0.35)
  Top 0.2: v5.61,17.15 4.91,16.45 4.56,16.45 M1.12 | v6.83,25.73 8.23,25.73 v11.56,29.05 | v19.43,36.4 19.43,36.92 18.03,38.33 17.51,38.33 17.33,38.15 U1.38
  Bottom 0.2: v5.61,17.15 5.61,19.25 4.56,20.3 4.56,24.5 4.21,24.85 4.21,25.2 4.73,25.73 v6.83,25.73 | v11.56,29.05 12.78,29.05 17.33,33.6 17.33,33.77 19.43,35.88 v19.43,36.4
GND  (via drill 0.35)
  Top 0.2: 18.03,52.33 18.03,55.83 C9.2 | J4.1 19.08,51.27 19.08,52.05 18.74,52.39 18.1,52.39 18.03,52.33 | 16.46,51.98 17.68,51.98 18.03,52.33 | 16.46,51.98 15.58,51.98 15.06,52.5 15.06,52.85 U2.2 | 16.46,51.98 16.46,48.65 16.81,48.3 17.68,48.3 21.71,44.27 22.23,44.27 D1.C 22.41,44.1 22.76,44.1 24.33,42.52 25.21,42.52 26.08,41.65 26.08,37.45 24.86,36.23 J5.13 24.86,36.05 24.86,35.35 26.08,34.12 26.08,30.62 25.38,29.93 24.33,29.93 22.41,28 22.41,27.12 | M1.18 4.56,7.35 5.43,7.35 5.61,7.53 5.61,8.4 5.61,13.82 v5.99,13.82 5.99,14.34 5.45,14.88 4.56,14.88 M1.13 | v12.08,17.68 11.73,17.32 11.73,14.35 M1.19 | 5.08,61.95 D2.C | 5.26,53.38 S1.1 | 22.41,21.7 R7.1 | 19.96,27.3 19.43,26.77 19.43,25.2 18.73,24.5 18.73,21.88 R8.1 18.73,21.7 v17.86,20.82 | 19.96,27.3 20.31,27.3 21.01,26.6 | 21.01,26.6 21.01,26.25 SJ1.2 | R7.1 22.41,21.88 22.41,22.93 21.01,24.32 21.01,26.07 SJ1.2 | 22.41,27.12 23.46,26.07 24.68,26.07 J5.9 | 22.41,27.12 21.53,27.12 21.01,26.6 | 21.01,26.6 SJ1.2 | 12.43,33.25 11.91,33.77 10.86,33.77 U1.5 | 12.43,33.25 12.78,32.9 12.78,30.8 11.73,29.75 7.53,29.75 6.48,28.7 5.61,28.7 3.82,26.91 3.82,24.13 3.97,23.98 4.73,23.98 D3.C 4.91,23.98 5.57,23.98 5.72,24.13 5.72,24.79 v5.78,24.85 | 5.43,38.15 5.43,37.1 C4.2 | 5.43,38.15 5.43,38.5 C2.1 5.43,38.15 | J6.3 13.48,50.75 12.26,50.75 J6.5 12.08,50.58 | 9.63,50.75 J6.9 9.63,50.58 | 14.71,25.9 C6.2 U1.18 14.84,31.63 15.58,32.38 | 15.58,32.38 16.63,33.42 | 16.63,33.42 18.48,35.27 U1.35 | 16.63,33.42 v15.41,34.65 | 15.06,42 C3.2 15.23,41.83 15.23,41.29 15.57,40.96 16.52,40.96 16.84,40.64 16.84,40.06 C5.2 | v11.21,49.35 11.21,49.52
  Top 0.2: v13.83,34.65 12.43,33.25 | 19.96,27.3 19.96,28 15.58,32.38 | 11.73,53.73 R12.1 | v15.41,36.05 15.34,36.12 U1.42 15.36,37.29 15.36,38.21 15.88,38.73 16.2,38.73 16.84,39.37 16.84,40.01 | M1.9 22.24,20.32 22.23,20.32 22.45,20.54 R7.1 | 5.41,37.15 4.45,37.15 4.14,36.83 4.14,34.92 3.18,33.97 3.18,32.38 3.98,31.59 | 3.98,31.59 4.14,31.43 | C1.2 4.14,31.75 3.98,31.59
  Bottom 0.2: 6.31,18.38 6.31,21.7 J2.GND4 6.31,21.88 6.31,24.32 v5.78,24.85 | J2.GND2 5.61,12.25 6.31,12.95 6.31,13.51 v5.99,13.82 6.04,13.88 6.04,14.92 6.31,15.19 6.31,18.38 | 6.31,18.38 11.38,18.38 v12.08,17.68 13.13,16.62 14.88,16.62 19.26,12.25 21.18,12.25 J2.GND1 | 12.96,38.5 v15.41,36.05 v15.41,34.65 v13.83,34.65 | v9.46,38.15 12.61,38.15 12.96,38.5 | v10.86,52.85 10.86,49.7 v11.21,49.35 11.21,41.12 11.27,41.12 12.39,40.01 12.39,39.07 12.96,38.5 | J2.6 16.64,21.46 16.84,21.27 17.41,21.27 v17.86,20.82
  pour Top (rank 6, no thermals): 0.01,63.18 26.68,63.18 26.68,4.45 0.01,4.45
  pour Bottom (rank 6, no thermals): 26.68,63.18 0.01,63.18 0.01,4.45 26.68,4.45
  pour Top (rank 2, no thermals): 20.65,27.3 20.65,25.08 21.6,25.08 21.6,27.3
N$2
  Top 0.2: C2.2 5.43,40.08 5.96,40.08 6.66,39.38 7.18,39.38 Y1.P$2 7.36,39.2 9.28,39.2 10.16,38.33 10.16,37.48 10.8,36.83 10.8,35.81 U1.1
N$3
  Top 0.406: D4.C 21.6,58.42 21.92,58.42 21.92,58.4 R11.2
N$4
  Top 0.2: 5.78,35.35 5.43,35.35 C4.1 5.78,35.35 | 5.78,35.35 7.18,36.75 Y1.P$1 | 5.78,35.35 6.66,34.48 7.01,34.48 7.18,34.65 8.06,34.65 8.68,35.27 U1.2
N$5  (via drill 0.35)
  Top 0.2: U2.1 13.98,52.07 14.19,51.87 14.99,51.87 v15.58,51.27 | R11.1 24.34,58.4 v24.46,58.27
  Bottom 0.2: v15.58,51.27 16.11,51.27 23.11,58.27 v24.46,58.27
N$6
  Top 0.406: U2.5 11.94,55.59 R12.2
N$8
  Top 0.2: D1.A 20.48,44.1 18.73,44.1 R5.1
N$10
  Top 0.2: 5.61,44.27 5.61,44.98 R13.2 | 5.61,44.27 5.61,43.58 R14.1 | 5.61,44.27 8.76,44.27 9.22,43.81 10.8,43.81 SJ2.2
  pour Top (rank 2, no thermals): 9.53,42.55 12.07,42.55 12.07,44.13 9.53,44.13
N$11  (via drill 0.35)
  Top 0.2: v20.83,18.38 20.83,21.7 R7.2 | M1.6 22.23,14.88 21.18,14.88 v20.83,15.22
  Bottom 0.2: v20.83,15.22 v20.83,18.38
N$12  (via drill 0.35)
  Top 0.2: v11.21,17.68 14.71,21.18 14.71,21.7 R10.1 | v16.46,12.43 16.46,11.2 v17.86,9.8 | M1.7 23.16,16.32 v23.46,16.62
  Bottom 0.2: v16.46,12.43 v11.21,17.68 | v17.86,9.8 21.53,9.8 23.46,11.72 v23.46,16.62
N$13  (via drill 0.35)
  Top 0.2: v23.46,24.15 22.06,25.55 22.06,26.07 SJ1.1 | v18.91,20.12 18.91,17.68 17.68,16.45 17.68,16.1 18.21,15.57 18.56,15.57 20.81,17.82 M1.8
  Bottom 0.2: v23.46,24.15 23.46,21.7 21.88,20.12 v18.91,20.12
  pour Top (no thermals): 21.6,26.35 21.6,25.08 22.87,25.08 22.87,26.35
N$14
  Top 0.2: D3.A 6.66,23.98 9.81,23.98 R9.1
N$15
  Top 0.254: D2.A 5.09,59.37 5.41,59.05 R6.1
N$16
  Bottom 0.2: SJ3.2 19.96,24.85 19.96,22.75 J2.CD1
  pour Bottom (rank 2, no thermals): 18.74,25.4 20.96,25.4 20.96,24.45 20.33,24.45 20.33,23.81 18.74,23.81
N$18
  Top 0.406: D5.A 19.69,60.64 18.42,59.37 18.42,58.74 18.11,58.42 16.2,58.42 15.57,57.78 14.61,57.78 14.54,57.85 J1.VBUS1
SCL  (via drill 0.35)
  Top 0.2: v23.46,34.83 23.46,36.58 23.63,36.75 23.63,38.15 21.71,40.08 R3.1 | v22.23,32.02 20.48,33.77 19.43,33.77 U1.32
  Bottom 0.2: 23.46,32.02 23.46,29.93 24.68,28.7 J5.10 | 23.46,32.02 v23.46,34.83 | 23.46,32.02 v22.23,32.02
SDA  (via drill 0.35)
  Top 0.2: v20.13,38.15 20.13,40.08 R2.1 | v18.03,33.6 18.38,33.25 19.26,33.25 U1.31 | v21.53,33.6 23.98,31.15 24.68,31.15 J5.11
  Bottom 0.2: v20.13,38.15 20.13,35.7 19.78,35.35 | v18.03,33.6 19.78,35.35 | 19.78,35.35 v21.53,33.6
SPI_MISO  (via drill 0.35)
  Top 0.2: v15.93,24.85 15.93,26.07 16.34,26.48 U1.21
  Bottom 0.2: J2.7 17.86,22.57 17.86,22.23 19.26,20.82 22.06,20.82 22.76,21.52 22.76,24.32 23.28,24.85 23.63,24.85 24.86,23.62 J5.8 | 17.68,22.75 J2.7 | v15.93,24.85 17.39,24.85 17.79,24.45 17.79,22.75 J2.7
SPI_MOSI  (via drill 0.35)
  Top 0.2: U1.19 15.34,27.02 v15.41,26.95
  Bottom 0.2: J5.6 24.68,18.55 24.16,19.07 15.76,19.07 13.48,21.35 13.48,22.57 J2.3 13.48,22.75 13.48,24.5 15.41,26.43 v15.41,26.95
SPI_SCK  (via drill 0.35)
  Top 0.2: v15.06,20.65 v13.83,19.43 | U1.20 15.84,30.02 v15.76,30.1
  Bottom 0.2: J5.7 24.68,20.82 23.28,19.43 17.25,19.43 15.54,21.14 | v15.76,30.1 15.06,30.1 12.08,27.12 12.08,26.07 10.51,24.5 10.33,24.5 9.11,23.27 9.11,21.7 11.38,19.43 v13.83,19.43 | J2.5 15.54,21.14 | 15.54,21.14 v15.06,20.65
SWCLK  (via drill 0.35)
  Top 0.2: U1.45
  Top 0.254: U1.45 13.84,38.26 v14.18,38.6 | v13.24,39.51 13.24,42.76 13.5,43.02 J6.4
  Bottom 0.254: v14.18,38.6 14.15,38.6 v13.24,39.51
SWDIO
  Top 0.254: U1.46 13.34,38.69 13.98,39.32 13.98,42.54 14.77,43.34 J6.2
USB_D+  (via drill 0.35)
  Top 0.254: U1.34 20.81,34.77 arc90 v21.28,35.24
  Top 0.406: J1.D+1 13.24,57.37 arc-90 v13.03,57.15
  Bottom 0.406: v13.03,57.15 13.03,42.55 arc90 15.57,39.69 20.01,39.69 arc-90 21.28,38.42 v21.28,35.24
USB_D-  (via drill 0.35)
  Top 0.254: U1.33 21.9,34.27 arc90 v21.92,34.29
  Top 0.406: J1.D-1 13.89,57.23 arc90 v13.98,57.15
  Bottom 0.406: v13.98,57.15 13.98,42.55 arc90 15.88,40.64 20.33,40.64 arc-90 22.23,38.42 22.23,34.61 arc-90 v21.92,34.29
V_BATT  (via drill 0.35)
  Top 0.2: 22.23,56.17 D6.A 22.41,56.17 | 19.61,56 C9.1 | 15.93,53.02 U2.3 | v14.71,46.9 12.08,46.9 11.56,46.38 11.56,44.62 11.38,44.45 9.28,44.45 8.76,44.98 7.36,44.98 R13.1 | 19.43,56 19.47,56
  Top 0.406: v22.41,51.98 22.33,51.98 21.92,52.39 21.92,54.61 22.23,54.93 22.23,56.19 D6.A 20.96,56.2 20.77,56 19.61,56 19.47,56 | 15.93,53.02 16.52,53.02 16.54,53.02 16.73,53.21 16.73,56.41 17.15,56.83 19.38,56.83 19.69,56.52 19.69,55.98 C9.1
  Top 0.61: v22.87,49.21 19.22,49.21 J4.2
  Bottom 0.2: v14.71,46.9 21.2,46.9 21.28,46.82
  Bottom 0.61: v22.41,51.98 22.87,51.52 v22.87,49.21 21.92,49.21 21.28,48.58 21.28,46.82 21.28,43.81 23.5,41.59 24.46,41.59 J5.15
  pour Bottom (no thermals): 25.41,42.55 24.14,42.55 23.5,43.18 23.5,54.61 23.19,54.93 20.01,54.93 16.2,51.12 14.61,49.53 14.61,46.35 14.93,46.04 19.69,46.04 20.01,45.72 20.01,43.81 23.82,40.01 25.41,40.01 25.73,40.32 25.73,42.23
VDDANA
  Top 0.2: C1.1 5.96,31.85 5.96,32.9 L1.2 5.96,33.08 7.05,33.08 7.31,33.34 9.2,33.34 9.28,33.25 10.68,33.25 U1.6
VDDCORE
  Top 0.2: U1.43 14.84,38.33 15.25,38.73 15.25,39.95 C5.1
VUSB  (via drill 0.35)
  Top 0.254: D4.A 20.89,61.84 20.65,61.59 20.65,60.64 19.69,59.69 D5.C
  Top 0.406: 19.5,57.47 16.52,57.47 15.88,56.83 U2.4 15.88,54.61 15.57,54.29 13.66,54.29 13.03,53.66 13.03,52.39 12.71,52.07 10.49,52.07 10.17,52.39 10.17,54.93 9.85,55.24 7.63,55.24 7.36,55.52 C7.1 | 19.5,57.47 22.23,57.47 22.55,57.15 25.09,57.15 25.41,56.83 D6.C 25.41,56.19 25.41,55.24 25.66,54.99 v25.73,54.99 | D5.C 19.69,57.66 19.5,57.47 | U3.3 1.76,57.31 1.91,57.15 3.5,57.15 3.66,57.31 | U3.1 3.66,57.31 | 3.66,57.31 4.72,57.31 R6.2 7.26,56.62 C7.1 | C8.1 6.99,58.74 7.31,58.42 7.31,56.56 C7.1
  Bottom 0.61: J5.16 25.09,43.81 25.73,44.45 v25.73,54.99
  pour Bottom (rank 2, no thermals): 23.5,42.55 23.5,53.34 0.01,53.34 0.01,63.18 26.68,63.18 26.68,42.55

### Text on the board
tPlace: ON | CHRG | RST | GND | VCC | J2 | L | Giuseppe / Caccavale | J1 | WIFI
bPlace: www.danyboard.com | J3
Label_BOTTOM: AREF | VIN (MAX 5V) | DAC0/A0 | VBAT | A1 | 3.3V | A2 | GND | A3 | RESET | A4 | SDA | A5 | SCL | GND | RX <- 0 | TX -> 1 | MISO | 2 | SCK | 3 | MOSI | 4 | 13 | 5 | 12 | 6 | 11 | 7 | 10 | 8 | 9